# Altium schematic sheet P02 Block Diagram.SchDoc
size 297 x 209 mm
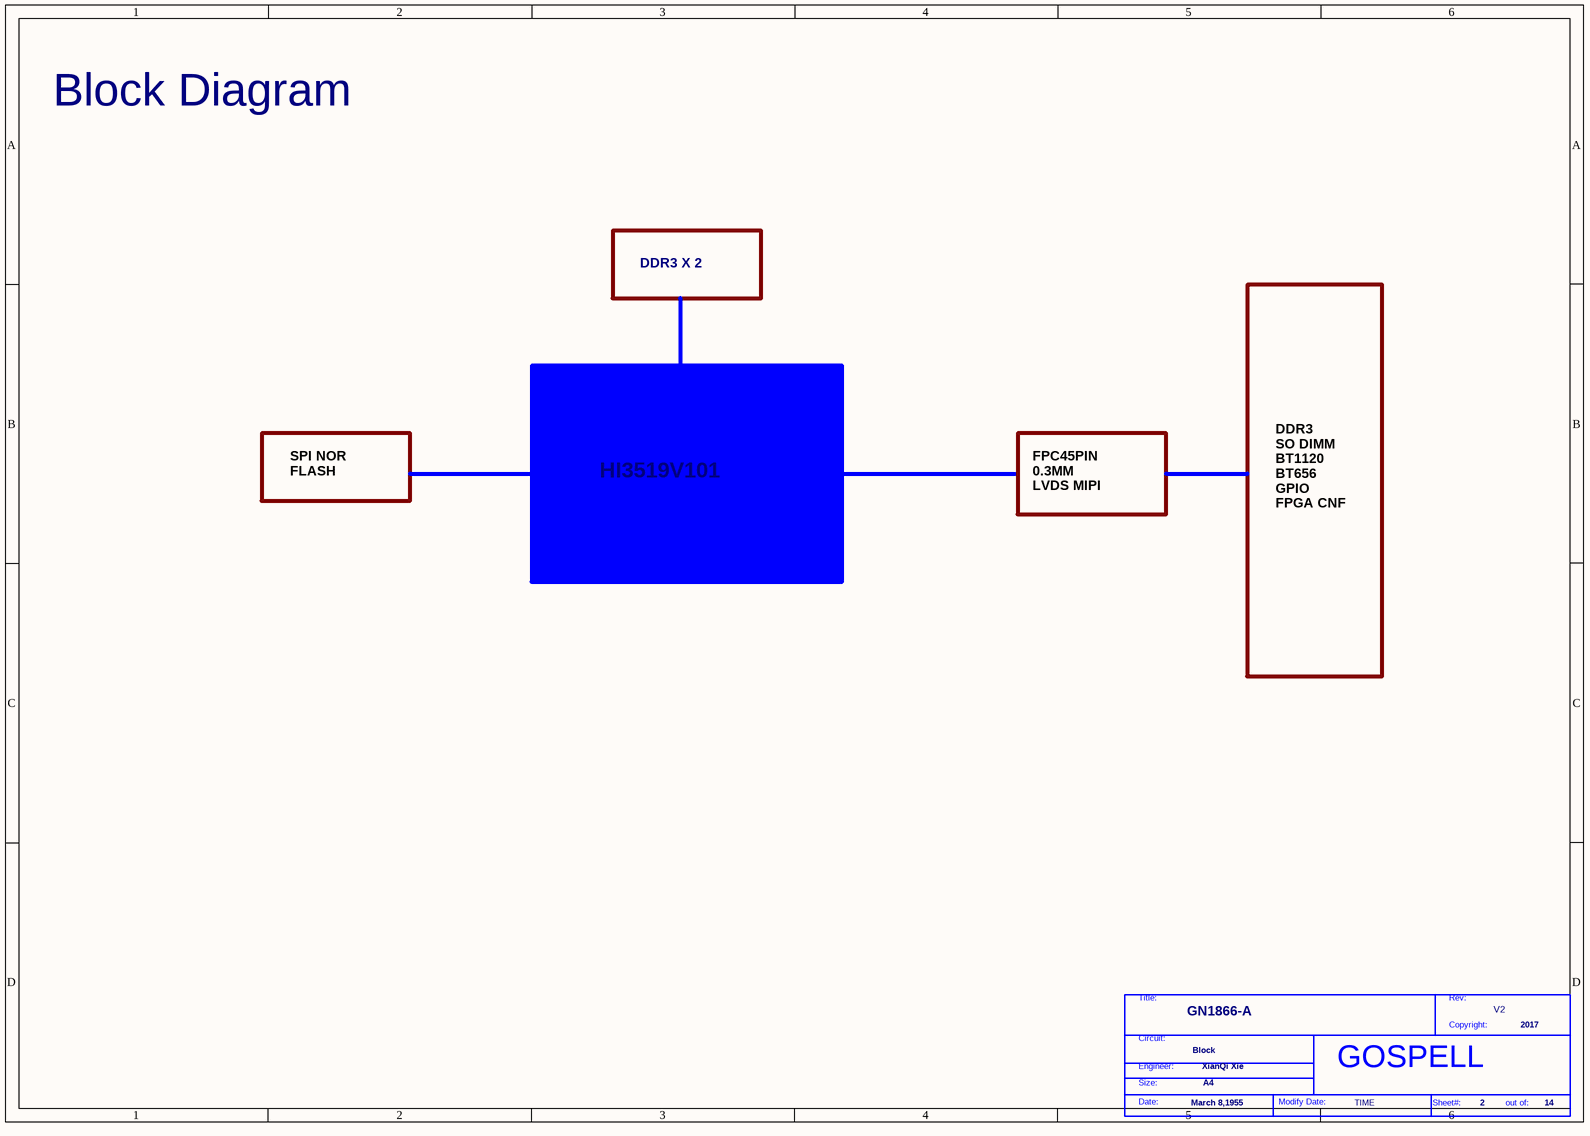
[diagram p0: P02 Block Diagram.SchDoc]

## Parts
*  Page Modify Date: TIME  Engineer: XianQi Xie  Copyright: 2017  Title: GN1866-A  RevCode: V2  Page Size: A4  Page Create Date: March 8,1955  Page Number: 2  Page Count: 14  Doc: Block  (hidden comment: GOSPELL)  (graphical)

## Notes on the sheet
- Block Diagram
- DDR3 X 2
- SPI NOR
  FLASH
- FPC45PIN
  0.3MM
  LVDS MIPI
- DDR3
  SO DIMM
  BT1120
  BT656
  GPIO
  FPGA CNF
- HI3519V101
- (in symbol GOSPELL) Title:; Rev:; Copyright:; Circuit:; Engineer:; Size:; Date:; Modify Date:; Sheet#:; out of:

## Library data of the parts
* = GOSPELL: Cage Code: 2017